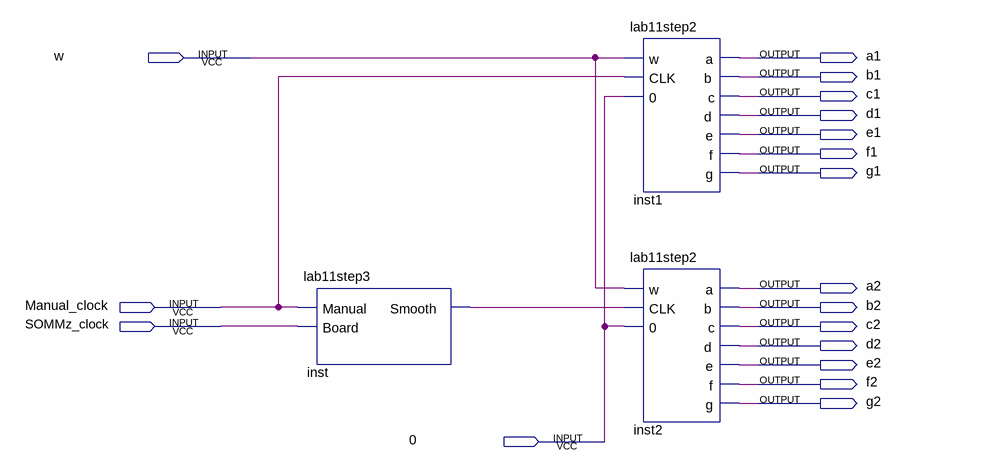
[diagram p0: schematic sheet]
// Quartus schematic lab11step4.bdf as structural Verilog: 3 symbols, 18 pins
module lab11step4 (
  input  w,
  input  Manual_clock,
  input  SOMMz_clock,
  input  \0 ,
  output a1,
  output b1,
  output c1,
  output d1,
  output e1,
  output f1,
  output g1,
  output a2,
  output b2,
  output c2,
  output d2,
  output e2,
  output f2,
  output g2
);

  wire inst_smooth;

  lab11step3 inst (.Manual(Manual_clock), .Board(SOMMz_clock), .Smooth(inst_smooth));
  lab11step2 inst1 (.w(w), .CLK(Manual_clock), .\0 (\0 ), .a(a1), .b(b1), .c(c1), .d(d1), .e(e1), .f(f1), .g(g1));
  lab11step2 inst2 (.w(w), .CLK(inst_smooth), .\0 (\0 ), .a(a2), .b(b2), .c(c2), .d(d2), .e(e2), .f(f2), .g(g2));
endmodule
